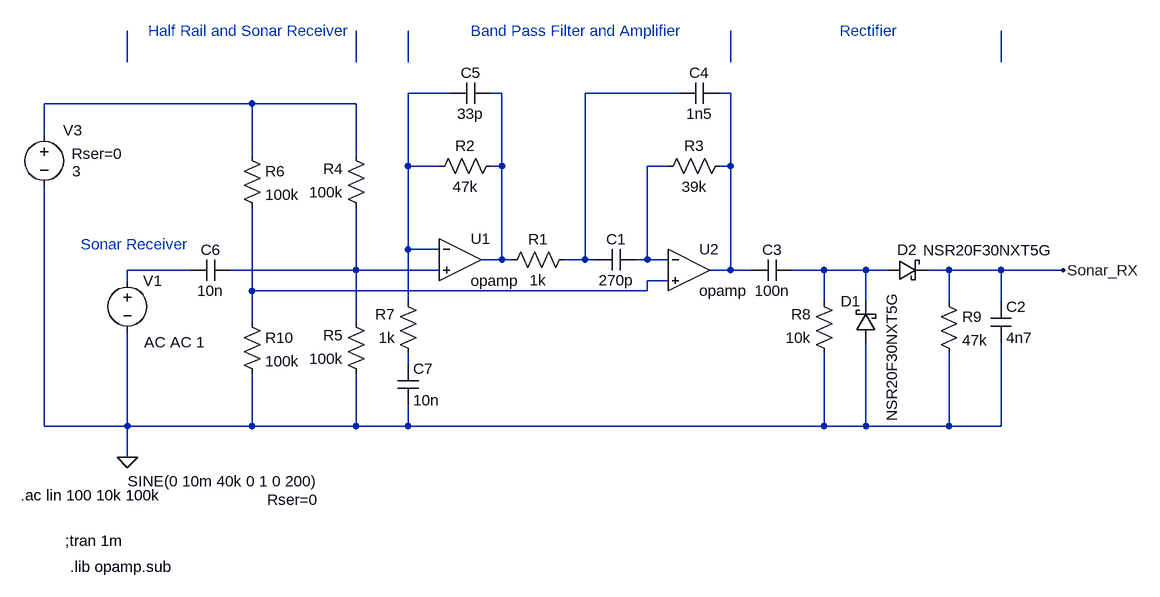
[diagram p0: schematic sonar amp and bandpass filter.asc]
sonar amp and bandpass filter.asc, the LTspice schematic file:
Version 4
SHEET 1 1288 680
WIRE -448 -176 -448 -224
WIRE -96 -176 -96 -224
WIRE -16 -176 -16 -224
WIRE 480 -176 480 -224
WIRE 896 -176 896 -224
WIRE 48 -128 -16 -128
WIRE 128 -128 112 -128
WIRE 400 -128 256 -128
WIRE 480 -128 464 -128
WIRE -256 -112 -576 -112
WIRE -96 -112 -256 -112
WIRE -576 -64 -576 -112
WIRE -256 -32 -256 -112
WIRE -96 -32 -96 -112
WIRE -16 -16 -16 -128
WIRE 32 -16 -16 -16
WIRE 128 -16 128 -128
WIRE 128 -16 112 -16
WIRE 384 -16 352 -16
WIRE 480 -16 480 -128
WIRE 480 -16 464 -16
WIRE -16 112 -16 -16
WIRE 32 112 -16 112
WIRE 128 128 128 -16
WIRE 128 128 96 128
WIRE 144 128 128 128
WIRE 256 128 256 -128
WIRE 256 128 224 128
WIRE 272 128 256 128
WIRE 352 128 352 -16
WIRE 352 128 336 128
WIRE 384 128 352 128
WIRE -352 144 -448 144
WIRE -96 144 -96 48
WIRE -96 144 -288 144
WIRE 32 144 -96 144
WIRE 480 144 480 -16
WIRE 480 144 448 144
WIRE 512 144 480 144
WIRE 624 144 576 144
WIRE 688 144 624 144
WIRE 720 144 688 144
WIRE 816 144 784 144
WIRE 896 144 816 144
WIRE 992 144 896 144
WIRE -448 160 -448 144
WIRE 384 160 352 160
WIRE -256 176 -256 48
WIRE 352 176 352 160
WIRE 352 176 -256 176
WIRE -16 192 -16 112
WIRE 624 192 624 144
WIRE 688 192 688 144
WIRE 816 192 816 144
WIRE 896 192 896 144
WIRE -256 224 -256 176
WIRE -96 224 -96 144
WIRE -16 288 -16 272
WIRE -576 384 -576 16
WIRE -448 384 -448 240
WIRE -448 384 -576 384
WIRE -256 384 -256 304
WIRE -256 384 -448 384
WIRE -96 384 -96 304
WIRE -96 384 -256 384
WIRE -16 384 -16 352
WIRE -16 384 -96 384
WIRE 624 384 624 272
WIRE 624 384 -16 384
WIRE 688 384 688 256
WIRE 688 384 624 384
WIRE 816 384 816 272
WIRE 816 384 688 384
WIRE 896 384 896 256
WIRE 896 384 816 384
WIRE -448 432 -448 384
FLAG -448 432 0
FLAG 992 144 Sonar_RX
SYMBOL res 240 112 R90
WINDOW 0 0 56 VBottom 2
WINDOW 3 32 56 VTop 2
SYMATTR InstName R1
SYMATTR Value 1k
SYMBOL cap 336 112 R90
WINDOW 0 0 32 VBottom 2
WINDOW 3 32 32 VTop 2
SYMATTR InstName C1
SYMATTR Value 270p
SYMBOL res 128 -32 R90
WINDOW 0 0 56 VBottom 2
WINDOW 3 32 56 VTop 2
SYMATTR InstName R2
SYMATTR Value 47k
SYMBOL res 480 -32 R90
WINDOW 0 0 56 VBottom 2
WINDOW 3 32 56 VTop 2
SYMATTR InstName R3
SYMATTR Value 39k
SYMBOL res -80 64 R180
WINDOW 0 36 76 Left 2
WINDOW 3 36 40 Left 2
SYMATTR InstName R4
SYMATTR Value 100k
SYMBOL res -80 320 R180
WINDOW 0 36 76 Left 2
WINDOW 3 36 40 Left 2
SYMATTR InstName R5
SYMATTR Value 100k
SYMBOL res 0 288 R180
WINDOW 0 36 76 Left 2
WINDOW 3 36 40 Left 2
SYMATTR InstName R7
SYMATTR Value 1k
SYMBOL res 640 288 R180
WINDOW 0 36 76 Left 2
WINDOW 3 36 40 Left 2
SYMATTR InstName R8
SYMATTR Value 10k
SYMBOL schottky 704 256 R180
WINDOW 0 24 64 Left 2
WINDOW 3 -24 -121 VRight 2
SYMATTR InstName D1
SYMATTR Value NSR20F30NXT5G
SYMATTR Description Diode
SYMATTR Type diode
SYMBOL schottky 720 160 R270
WINDOW 0 32 32 VTop 2
WINDOW 3 62 156 VBottom 2
SYMATTR InstName D2
SYMATTR Value NSR20F30NXT5G
SYMATTR Description Diode
SYMATTR Type diode
SYMBOL res 800 176 R0
SYMATTR InstName R9
SYMATTR Value 47k
SYMBOL cap 880 192 R0
SYMATTR InstName C2
SYMATTR Value 4n7
SYMBOL cap 576 128 R90
WINDOW 0 0 32 VBottom 2
WINDOW 3 32 32 VTop 2
SYMATTR InstName C3
SYMATTR Value 100n
SYMBOL cap 464 -144 R90
WINDOW 0 0 32 VBottom 2
WINDOW 3 32 32 VTop 2
SYMATTR InstName C4
SYMATTR Value 1n5
SYMBOL cap 112 -144 R90
WINDOW 0 0 32 VBottom 2
WINDOW 3 32 32 VTop 2
SYMATTR InstName C5
SYMATTR Value 33p
SYMBOL cap -288 128 R90
WINDOW 0 0 32 VBottom 2
WINDOW 3 32 32 VTop 2
SYMATTR InstName C6
SYMATTR Value 10n
SYMBOL voltage -448 144 R0
WINDOW 3 294 325 Right 2
WINDOW 123 26 111 Left 2
WINDOW 39 294 353 Right 2
SYMATTR InstName V1
SYMATTR Value SINE(0 10m 40k 0 1 0 200)
SYMATTR Value2 AC AC 1
SYMATTR SpiceLine Rser=0
SYMBOL voltage -576 -80 R0
WINDOW 0 29 9 Left 2
WINDOW 3 43 72 Left 2
WINDOW 123 0 0 Left 2
WINDOW 39 42 45 Left 2
SYMATTR InstName V3
SYMATTR Value 3
SYMATTR SpiceLine Rser=0
SYMBOL cap -32 288 R0
SYMATTR InstName C7
SYMATTR Value 10n
SYMBOL Opamps\\opamp 64 64 R0
SYMATTR InstName U1
SYMBOL Opamps\\opamp 416 80 R0
SYMATTR InstName U2
SYMBOL res -272 -48 R0
SYMATTR InstName R6
SYMATTR Value 100k
SYMBOL res -272 208 R0
SYMATTR InstName R10
SYMATTR Value 100k
TEXT -612 490 Left 2 !.ac lin 100 10k 100k
TEXT -544 560 Left 2 !;tran 1m
TEXT -536 600 Left 2 !.lib opamp.sub
TEXT -520 104 Left 2 ;Sonar Receiver
TEXT 80 -224 Left 2 ;Band Pass Filter and Amplifier
TEXT -416 -224 Left 2 ;Half Rail and Sonar Receiver
TEXT 648 -224 Left 2 ;Rectifier

The netlist it stands for:
* sonar amp and bandpass filter.asc
R1 N008 N007 1k
C1 N011 N008 270p
R2 N007 N006 47k
R3 N009 N011 39k
R4 N013 N010 100k
R5 0 N013 100k
R7 N016 N006 1k
R8 0 N014 10k
D1 0 N014 NSR20F30NXT5G
D2 N014 Sonar_RX NSR20F30NXT5G
R9 Sonar_RX 0 47k
C2 Sonar_RX 0 4n7
C3 N014 N009 100n
C4 N009 N008 1n5
C5 N007 N006 33p
C6 N013 N012 10n
V1 N012 0 SINE(0 10m 40k 0 1 0 200) AC AC 1 Rser=0
V3 N010 0 3 Rser=0
C7 N016 0 10n
XU1 N006 N013 N007 opamp Aol=100K GBW=10Meg  ; pins invin noninvin out
XU2 N011 N015 N009 opamp Aol=100K GBW=10Meg  ; pins invin noninvin out
R6 N010 N015 100k
R10 N015 0 100k
.model D D
.lib standard.dio
.ac lin 100 10k 100k
;tran 1m
.lib opamp.sub
* Sonar Receiver
* Band Pass Filter and Amplifier
* Half Rail and Sonar Receiver
* Rectifier
.backanno
.end